# EAGLE design amp_tone_control_v_1_0 (EAGLE 6.4)
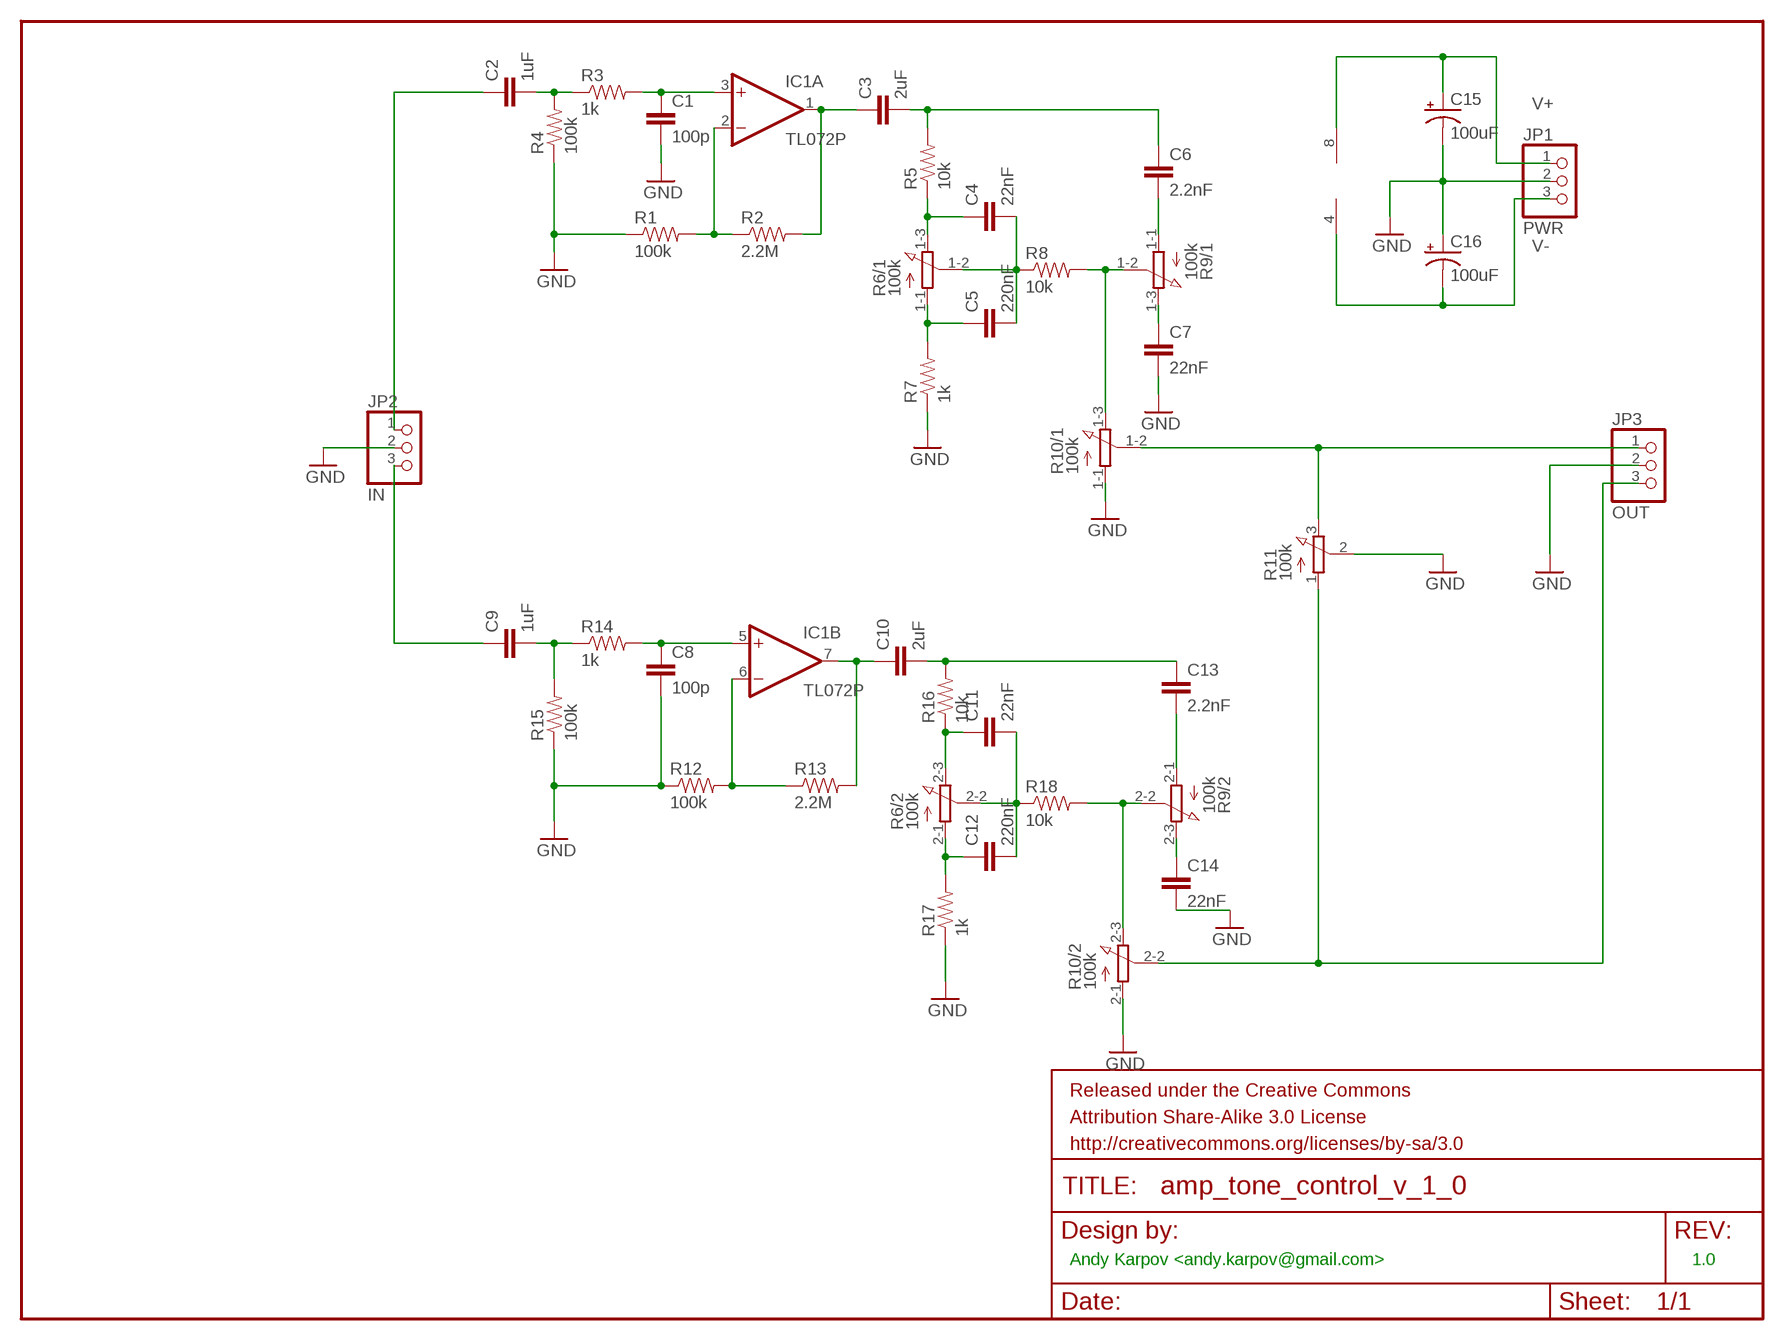
[diagram p0: schematic, sheet 1]

## Parts
C1  100p  CAPPTH1  [CAP-PTH-5MM]
C2  1uF  CAPPTH3  [CAP-PTH-LARGE]
C3  2uF  CAPPTH3  [CAP-PTH-LARGE]
C4  22nF  CAPPTH1  [CAP-PTH-5MM]
C5  220nF  CAPPTH1  [CAP-PTH-5MM]
C6  2.2nF  CAPPTH1  [CAP-PTH-5MM]
C7  22nF  CAPPTH3  [CAP-PTH-LARGE]
C8  100p  CAPPTH1  [CAP-PTH-5MM]
C9  1uF  CAPPTH3  [CAP-PTH-LARGE]
C10  2uF  CAPPTH3  [CAP-PTH-LARGE]
C11  22nF  CAPPTH1  [CAP-PTH-5MM]
C12  220nF  CAPPTH1  [CAP-PTH-5MM]
C13  2.2nF  CAPPTH1  [CAP-PTH-5MM]
C14  22nF  CAPPTH3  [CAP-PTH-LARGE]
C15  100uF  CAP_POLPTH1  [CPOL-RADIAL-100UF-25V]
C16  100uF  CAP_POLPTH1  [CPOL-RADIAL-100UF-25V]
FRAME1  FRAME-LETTER  [CREATIVE_COMMONS]
IC1  TL072P  [DIL08]
JP1  PWR  PINHD-1X3  [1X03]
JP2  IN  PINHD-1X3  [1X03]
JP3  OUT  PINHD-1X3  [1X03]
R1  100k  RESISTORPTH-1/4W  [AXIAL-0.4]
R2  2.2M  RESISTORPTH-1/4W  [AXIAL-0.4]
R3  1k  RESISTORPTH-1/4W  [AXIAL-0.4]
R4  100k  RESISTORPTH-1/4W  [AXIAL-0.4]
R5  10k  RESISTORPTH-1/4W  [AXIAL-0.4]
R6  100k  3RP/1610G  [3RP/1610G]
R7  1k  RESISTORPTH-1/4W  [AXIAL-0.4]
R8  10k  RESISTORPTH-1/4W  [AXIAL-0.4]
R9  100k  3RP/1610G  [3RP/1610G]
R10  100k  3RP/1610G  [3RP/1610G]
R11  100k  3RP/1610N  [3RP/1610N]
R12  100k  RESISTORPTH-1/4W  [AXIAL-0.4]
R13  2.2M  RESISTORPTH-1/4W  [AXIAL-0.4]
R14  1k  RESISTORPTH-1/4W  [AXIAL-0.4]
R15  100k  RESISTORPTH-1/4W  [AXIAL-0.4]
R16  10k  RESISTORPTH-1/4W  [AXIAL-0.4]
R17  1k  RESISTORPTH-1/4W  [AXIAL-0.4]
R18  10k  RESISTORPTH-1/4W  [AXIAL-0.4]

## Nets
GND: C1.2 C7.2 C8.2 C14.2 C15.2(-) C16.1(+) JP1.2 JP2.2 JP3.2 R1.P$1 R4.P$1 R7.P$1 R10.1-1(/1:A) R10.2-1(/2:A) R11.2(S) R12.P$1 R15.P$1 R17.P$1
N$1: IC1.2(A:-IN) R1.P$2 R2.P$1
N$2: C3.1 IC1.1(A:OUT) R2.P$2
N$3: C2.2 R3.P$1 R4.P$2
N$4: C1.1 IC1.3(A:+IN) R3.P$2
N$5: C9.1 JP2.3
N$8: C5.1 R6.1-1(/1:A) R7.P$2
N$10: R8.P$2 R9.1-2(/1:S) R10.1-3(/1:E)
N$11: C6.2 R9.1-1(/1:A)
N$12: C7.1 R9.1-3(/1:E)
N$13: JP3.1 R10.1-2(/1:S) R11.3(E)
N$14: C2.1 JP2.1
N$15: C9.2 R14.P$1 R15.P$2
N$17: C12.1 R6.2-1(/2:A) R17.P$2
N$18: C8.1 IC1.5(B:+IN) R14.P$2
N$20: IC1.6(B:-IN) R12.P$2 R13.P$1
N$21: C10.1 IC1.7(B:OUT) R13.P$2
N$22: C10.2 C13.1 R16.P$2
N$23: C13.2 R9.2-1(/2:A)
N$24: C11.1 R6.2-3(/2:E) R16.P$1
N$28: C14.1 R9.2-3(/2:E)
N$30: C11.2 C12.2 R6.2-2(/2:S) R18.P$1
N$31: C4.2 C5.2 R6.1-2(/1:S) R8.P$1
N$33: C4.1 R5.P$1 R6.1-3(/1:E)
N$36: C3.2 C6.1 R5.P$2
N$41: R9.2-2(/2:S) R10.2-3(/2:E) R18.P$2
N$43: JP3.3 R10.2-2(/2:S) R11.1(A)
V+: C15.1(+) IC1.8(P:V+) JP1.1
V-: C16.2(-) IC1.4(P:V-) JP1.3

## Notes on the sheet
- Andy Karpov <andy.karpov@gmail.com> | 1.0

## Library data of the parts
C1-C14 = SparkFun-Capacitors:CAP: Capacitor Standard 0603 ceramic capacitor, and 0.1" leaded capacitor.
C15 C16 = SparkFun-Capacitors:CAP_POL: Capacitor Polarized These are standard SMD and PTH capacitors. Normally 10uF, 47uF, and 100uF in electrolytic and tantalum varieties. Always verify the external diameter of the through hole cap, it varies with capacity, voltage, and manufacturer. The EIA devices should be standard.
FRAME1 = SparkFun-Aesthetics:FRAME-LETTER: Schematic Frame Standard 8.5x11 US Letter frame
IC1 = linear:TL072: OP AMP
JP1-JP3 = pinhead:PINHD-1X3: PIN HEADER
R1-R5 R7 R8 R12-R18 = SparkFun-Passives:RESISTOR: Resistor Basic schematic elements and footprints for 0603, 1206, and PTH resistors.
R6 R9 R10 = pot:3RP/1610G: 16mm Potentiometer two level Source: http://www.alphapotentiometers.net/html/16mm_pot_2.html
R11 = pot:3RP/1610N: 16mm Potentiometer one level Source: http://www.alphapotentiometers.net/html/16mm_pot_2.html

## Board
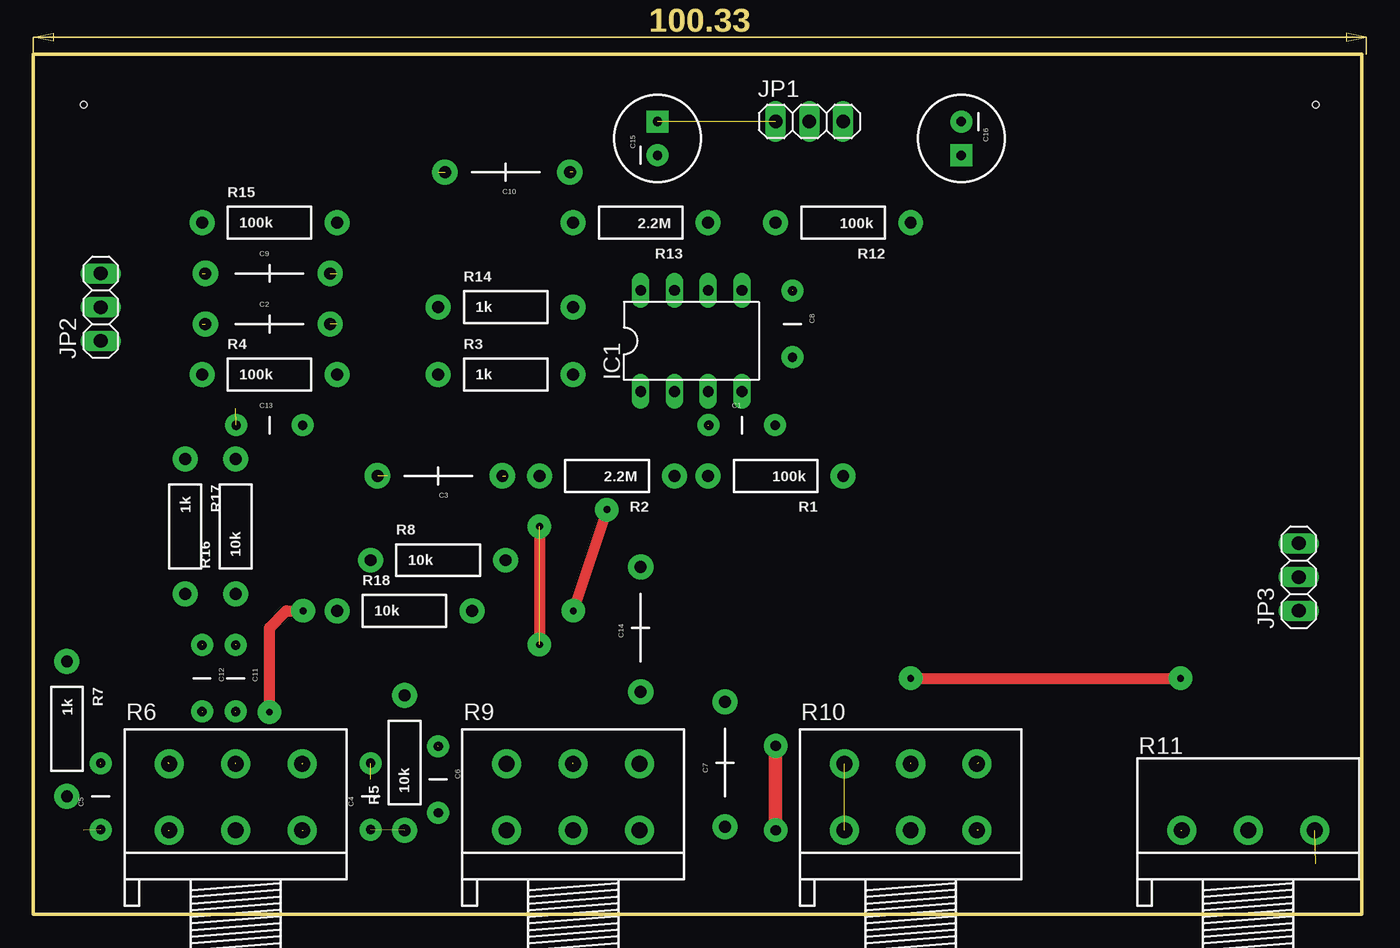
[diagram p1: board, top side]
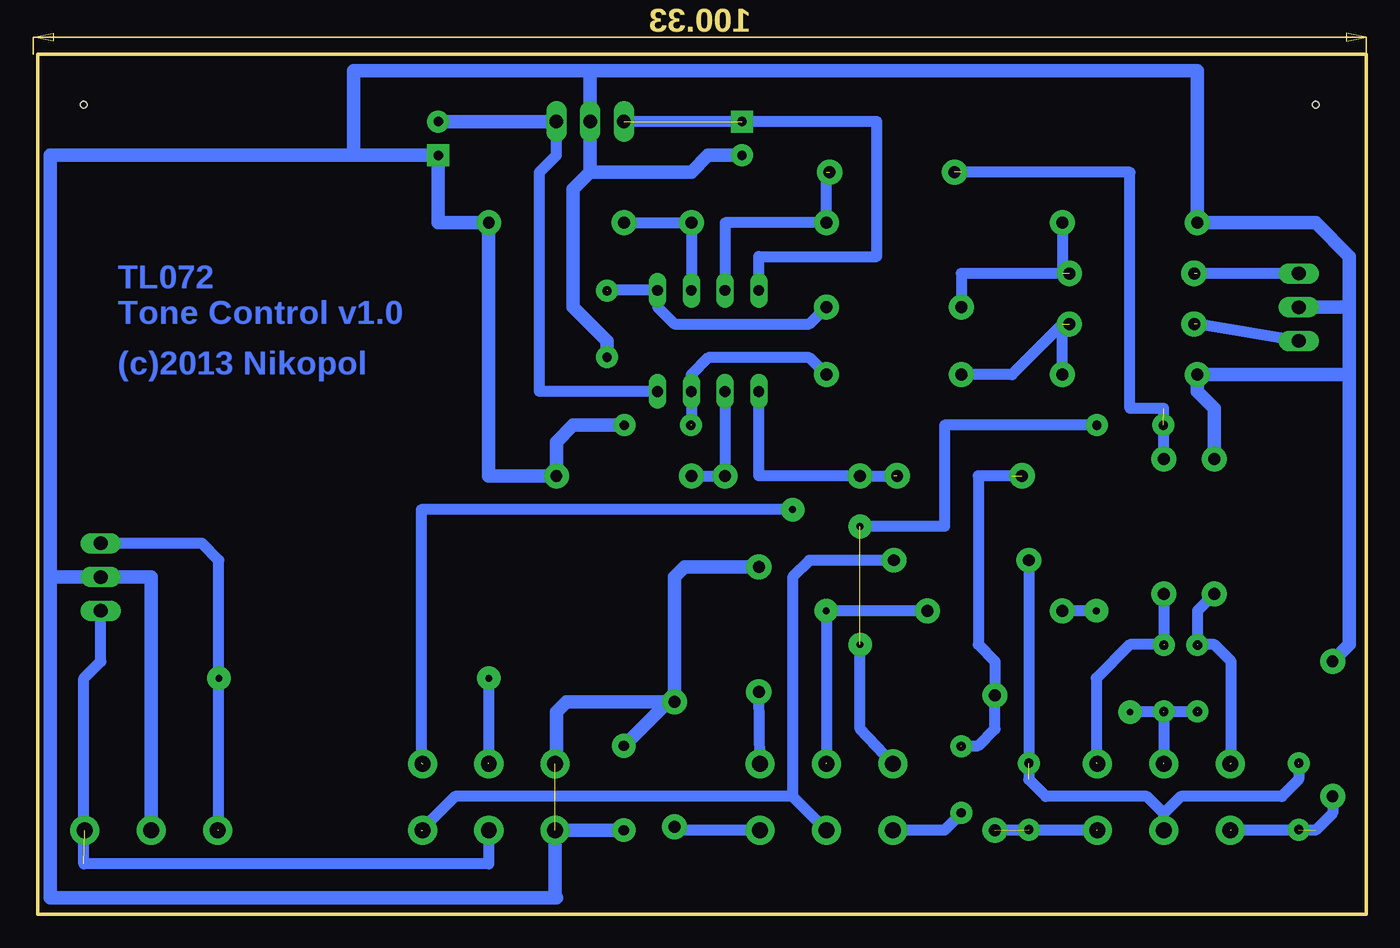
[diagram p2: board, bottom side, seen from below]

Size 100 x 64.76 mm. Coordinates in mm from the lower left corner, seen from the top.
Outline: 0,0 100,0 100,64.76 0,64.76 0,0
Copper layers (1*16): Top 0.035mm / dielectric 1.5mm / Bottom 0.035mm
Design rules "default": minimum track width 10mil, minimum drill 24mil, track to track 8mil, track to pad 8mil, pad to pad 8mil, via to via 8mil, smd to smd 8mil, copper to edge 40mil, drill to drill 8mil, minimum pad ring 10mil, minimum via ring 8mil, stop-mask expansion 4mil, vias tented up to drill 0mil, thermal gap 10mil
Holes 0.51 mm at 3.81,60.96 96.52,60.96

### Footprints (pad centres in the part's own frame; a part is rotated, then mirrored left to right if it is on the bottom)
CAP-PTH-5MM = drill 0.7 pad 1.651: 1 -2.5,0; 2 2.5,0
CAP-PTH-LARGE = drill 0.9 pad 1.905: 1 -4.826,0; 2 4.572,0
CPOL-RADIAL-100UF-25V = drill 0.7 pad 1.651 square: 1 1.27,0 | drill 0.7 pad 1.651: 2 -1.27,0
DIL08 = drill 0.813 pad 1.27 long: 1 -3.81,-3.81; 2 -1.27,-3.81; 3 1.27,-3.81; 4 3.81,-3.81; 5 3.81,3.81; 6 1.27,3.81; 7 -1.27,3.81; 8 -3.81,3.81
1X03 = drill 1.016 long: 1 -2.54,0; 2 0,0; 3 2.54,0
AXIAL-0.4 = drill 0.9 pad 1.88: P$1 -5.08,0; P$2 5.08,0
3RP/1610G = drill 1.2 pad 2.184: 1-1 -5,0; 1-2 0,0; 1-3 5,0; 2-1 -5,5; 2-2 0,5; 2-3 5,5
3RP/1610N = drill 1.2 pad 2.184: 1 -5,0; 2 0,0; 3 5,0

### Placement (x,y rotation side)
C1  53.34,36.83 0 top
C2  17.78,44.45 0 top
C3  30.48,33.02 180 top
C4  25.4,8.89 90 top
C5  5.08,8.89 90 top
C6  30.48,10.16 270 top
C7  52.07,11.43 90 top
C8  57.15,44.45 270 top
C9  17.78,48.26 0 top
C10  35.56,55.88 180 top
C11  15.24,17.78 270 top
C12  12.7,17.78 270 top
C13  17.78,36.83 0 top
C14  45.72,21.59 90 top
C15  46.99,58.42 90 top
C16  69.85,58.42 270 top
FRAME1  15.24,64.77 0 top
IC1  49.53,43.18 0 top
JP1  58.42,59.69 0 top
JP2  5.08,45.72 90 top
JP3  95.25,25.4 90 top
R1  55.88,33.02 180 top
R2  43.18,33.02 180 top
R3  35.56,40.64 0 top
R4  17.78,40.64 0 top
R5  27.94,11.43 90 top
R6  15.24,6.35 0 top
R7  2.54,13.97 270 top
R8  30.48,26.67 0 top
R9  40.64,6.35 0 top
R10  66.04,6.35 0 top
R11  91.44,6.35 0 top
R12  60.96,52.07 180 top
R13  45.72,52.07 180 top
R14  35.56,45.72 0 top
R15  17.78,52.07 0 top
R16  15.24,29.21 90 top
R17  11.43,29.21 270 top
R18  27.94,22.86 0 top

### Tracks (layer width: path | path; a pad name or v marks a point on that pad's centre or on a via)
GND  (1 unrouted)
  Bottom 1.016: R11.2 91.44,25.4 JP3.2 99.06,25.4 | R10.1-1 61.04,1.35 60.96,1.27 99.06,1.27 99.06,25.4 | 76.2,57.15 C16.1 69.85,52.07 R12.P$1 66.04,33.02 R1.P$1 60.96,35.56 59.69,36.83 C1.2 | 76.2,57.15 99.06,57.15 99.06,25.4 | C14.2 51.31,26.16 52.07,25.4 C7.2 60.2,16 60.96,15.24 60.96,11.43 R10.2-1 | JP2.2 1.27,45.72 | 1.27,45.72 1.27,40.64 | 1.27,40.64 1.27,20.32 R7.P$1 | R17.P$1 11.43,38.1 12.7,39.37 R4.P$1 1.27,40.64 | 1.27,45.72 1.27,49.53 3.81,52.07 R15.P$1 12.7,63.5 58.42,63.5 | C15.2 49.53,57.15 50.8,55.88 58.42,55.88 | 58.42,55.88 JP1.2 58.42,63.5 | 58.42,63.5 76.2,63.5 76.2,57.15 | C8.2 57.15,43.18 59.69,45.72 59.69,54.61 58.42,55.88
N$1
  Bottom 0.813: R1.P$2 R2.P$1 IC1.2
N$2  (1 unrouted)
  Bottom 0.813: IC1.1 45.72,33.02 R2.P$2 35.56,33.02
N$3  (1 unrouted)
  Bottom 0.813: R4.P$2 22.86,44.45 26.67,40.64 R3.P$1
N$4  (1 unrouted)
  Bottom 0.813: R3.P$2 41.91,41.91 49.53,41.91 50.8,40.64 IC1.3 50.8,36.83
N$5  (1 unrouted)
  Bottom 0.813: JP2.3 12.7,48.26
N$8  (2 unrouted)
  Bottom 0.813: R7.P$2 2.54,7.62 3.81,6.35 10.16,6.35
N$9  (via drill 0.76 pad 1.78)
  Top 1.016: v55.88,12.7 v55.88,6.35
  Bottom 1.016: v55.88,12.7 52.07,16.51 | v55.88,6.35 60.96,6.35
N$10  (1 unrouted)
  Bottom 0.813: R9.1-2 43.18,8.89 | 43.18,8.89 68.58,8.89 71.12,6.35 | R8.P$2 41.91,26.67 43.18,25.4 43.18,8.89
N$11
  Bottom 0.813: C6.2 30.48,7.62 31.75,6.35 R9.1-1
N$12
  Bottom 0.813: R9.1-3 51.82,6.35 C7.1
N$13  (1 unrouted)
  Bottom 0.813: JP3.1 95.25,19.05 96.52,17.78 96.52,3.81 66.04,3.81 R10.1-2
N$14  (1 unrouted)
  Bottom 0.813: JP2.1 12.7,44.45
N$15  (1 unrouted)
  Bottom 0.813: R15.P$2 22.86,48.26 30.48,48.26 R14.P$1
N$16  (via drill 0.51 pad 1.78)
  Top 0.813: v38.1,29.21 v38.1,20.32
N$17  (2 unrouted)
  Bottom 0.813: R17.P$2 12.7,22.86 12.7,20.32 11.43,20.32 10.16,19.05 10.16,11.43
N$18  (1 unrouted)
  Bottom 0.813: R14.P$2 41.91,44.45 52.07,44.45 53.34,45.72 IC1.5 57.15,46.99
N$20
  Bottom 0.813: R12.P$2 R13.P$1 IC1.6
N$21  (1 unrouted)
  Bottom 0.813: IC1.7 48.26,52.07 R13.P$2 40.64,55.88
N$22  (2 unrouted)
  Bottom 0.813: R16.P$2 15.24,38.1 17.78,38.1 17.78,55.88 30.48,55.88
N$23  (1 unrouted)
  Bottom 0.813: R9.2-1 38.1,13.97 38.1,20.32 | C13.2 31.75,36.83 31.75,29.21 38.1,29.21
N$24  (2 unrouted)
  Bottom 0.813: R16.P$1 15.24,20.32 17.78,20.32 20.32,17.78 20.32,11.43
N$28
  Bottom 0.813: R9.2-3 C14.1
N$30  (via drill 0.51 pad 1.78)  (3 unrouted)
  Top 0.813: v17.78,15.24 17.78,21.59 19.05,22.86 v20.32,22.86
  Bottom 0.813: 12.7,15.24 15.24,15.24 | 15.24,15.24 15.24,11.43 | 15.24,15.24 v17.78,15.24 | v20.32,22.86 R18.P$1
N$31  (2 unrouted)
  Bottom 0.813: 5.08,11.43 5.08,10.16 6.35,8.89 13.97,8.89 15.24,7.62 | R6.1-2 15.24,7.62 | 15.24,7.62 16.51,8.89 24.13,8.89 25.4,10.16 R8.P$1
N$33  (2 unrouted)
  Bottom 0.813: 20.32,6.35 R5.P$1
N$36  (2 unrouted)
  Bottom 0.813: 26.67,33.02 29.21,33.02 29.21,20.32 27.94,19.05 R5.P$2 27.94,13.97 29.21,12.7 30.48,12.7
N$41  (via drill 0.51 pad 1.78)  (2 unrouted)
  Top 0.813: v43.18,30.48 v40.64,22.86
  Bottom 0.813: v43.18,30.48 71.12,30.48 71.12,11.43 | R18.P$2 v40.64,22.86 40.64,11.43
N$43  (via drill 0.51 pad 1.78)  (2 unrouted)
  Top 0.813: v66.04,17.78 v86.36,17.78
  Bottom 0.813: v66.04,17.78 66.04,11.43 | 86.36,6.35 v86.36,17.78 86.36,26.67 87.63,27.94 JP3.3
V+  (1 unrouted)
  Bottom 0.813: IC1.8 45.72,49.53 36.83,49.53 36.83,59.69 JP1.1
V-
  Bottom 0.813: IC1.4 62.23,39.37 62.23,55.88 60.96,57.15 JP1.3
  Bottom 1.016: JP1.3 C16.2

### Text on the board
Bottom: TL072 / Tone Control v1.0 | (c)2013 Nikopol